# Altium schematic sheet current_sens.SchDoc
size A3
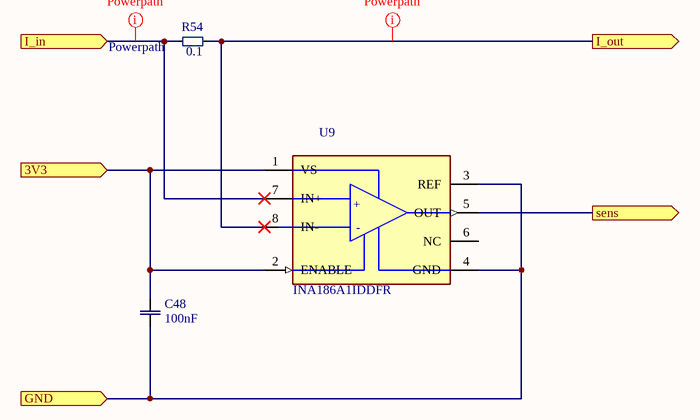
[diagram p0: current_sens.SchDoc]

## Parts
C48  Capacitance: 100nF  [cap0402]  (hidden comment: GRM155R71H104ME14D)
R54  Resistance: 0.1  [Chip2PinSM127P600-8N]  (hidden comment: ERJ-8BSFR10V)
U9  INA186A1IDDFR  [FP-DDF0008A-IPC_C]

## Ports
3V3 (in), GND (in), I_in (in), I_out (out), sens (out)

## Nets
3V3: C48.2 U9.1(VS) U9.2(ENABLE) ; port 3V3
GND: C48.1 U9.3(REF) U9.4(GND) ; port GND
I_in: R54.1 U9.7(IN+) ; port I_in
I_out: R54.2 U9.8(IN-) ; port I_out
sens: U9.5(OUT) ; port sens

Not connected (* = marked no-connect by the designer): U9 6(NC)

## Layout directives
net class Powerpath: I_in, I_out

## Notes on the sheet
- (in symbol CMP-ROOT-00032-7) +; -

## Library data of the parts
C48 = CMP-0001-00001-10: 0402 0.1 uF 50 V ±20% Tolerance X7R SMT Monolithic Ceramic Chip Capacitor; Value: 100nF; Voltage Rating: 50V; Length: 0.039inch; Packaging: Cut Tape; Max Operating Temperature: 125°C; Min Operating Temperature: -55°C; Mount: Surface Mount; Case/Package: 0402; Tolerance: 20%; Width: 0.02inch; Capacitor Type: Ceramic; Thickness: 0.022inch; Pins: 2; RoHS: Yes; LCSC Part#: C182412
R54 = CMP-0001-00003-4: Precision resistor, SMD 0.1 Ohm 0.33 W  ±  1 % 1206, ERJ8BSFR10V, Panasonic Automotive & Industrial Systems; Temperature Coefficient: 250ppm/°C; Tolerance: 1%; Value: 0.1; Max Power Dissipation: 500mW; Power Rating: 330mW; Length: 3.2mm; Width: 0.063inch; Number of Terminations: 2; Case Code (Metric): 3216; RoHS: Yes; Mount: Surface Mount; Military Standard: Not; Radiation Hardening: No; Contact Plating: Tin; Height: 0.6mm; Case Code (Imperial): 1206; Composition: Thick Film,Low-Ohm-Resistor; Min Operating Temperature: -55°C; Features: Automotive AEC-Q200; Max Operating Temperature: 125°C; Depth: 1.6mm; Packaging: Tape and Reel; Case/Package: 1206; Termination: SMD/SMT; Number of Pins: 2; Package Quantity: 5000; REACH SVHC: No SVHC; LCSC Part#: C2079636
U9 = CMP-ROOT-00032-7: 40V, bi-directional, high-precision current sense amplifier w/ picoamp IB & ENABLE 8-SOT-23-THIN -40 to 125; RoHS: Yes; Mount: SMD; Case/Package: SOT-23-8; LCSC Part#: C1852082